# Altium schematic sheet edison_gpio.SchDoc: Edison Breakout
size Letter; Author: Ye-Sheng Kuo; Revision: 1; SheetTotal: 9
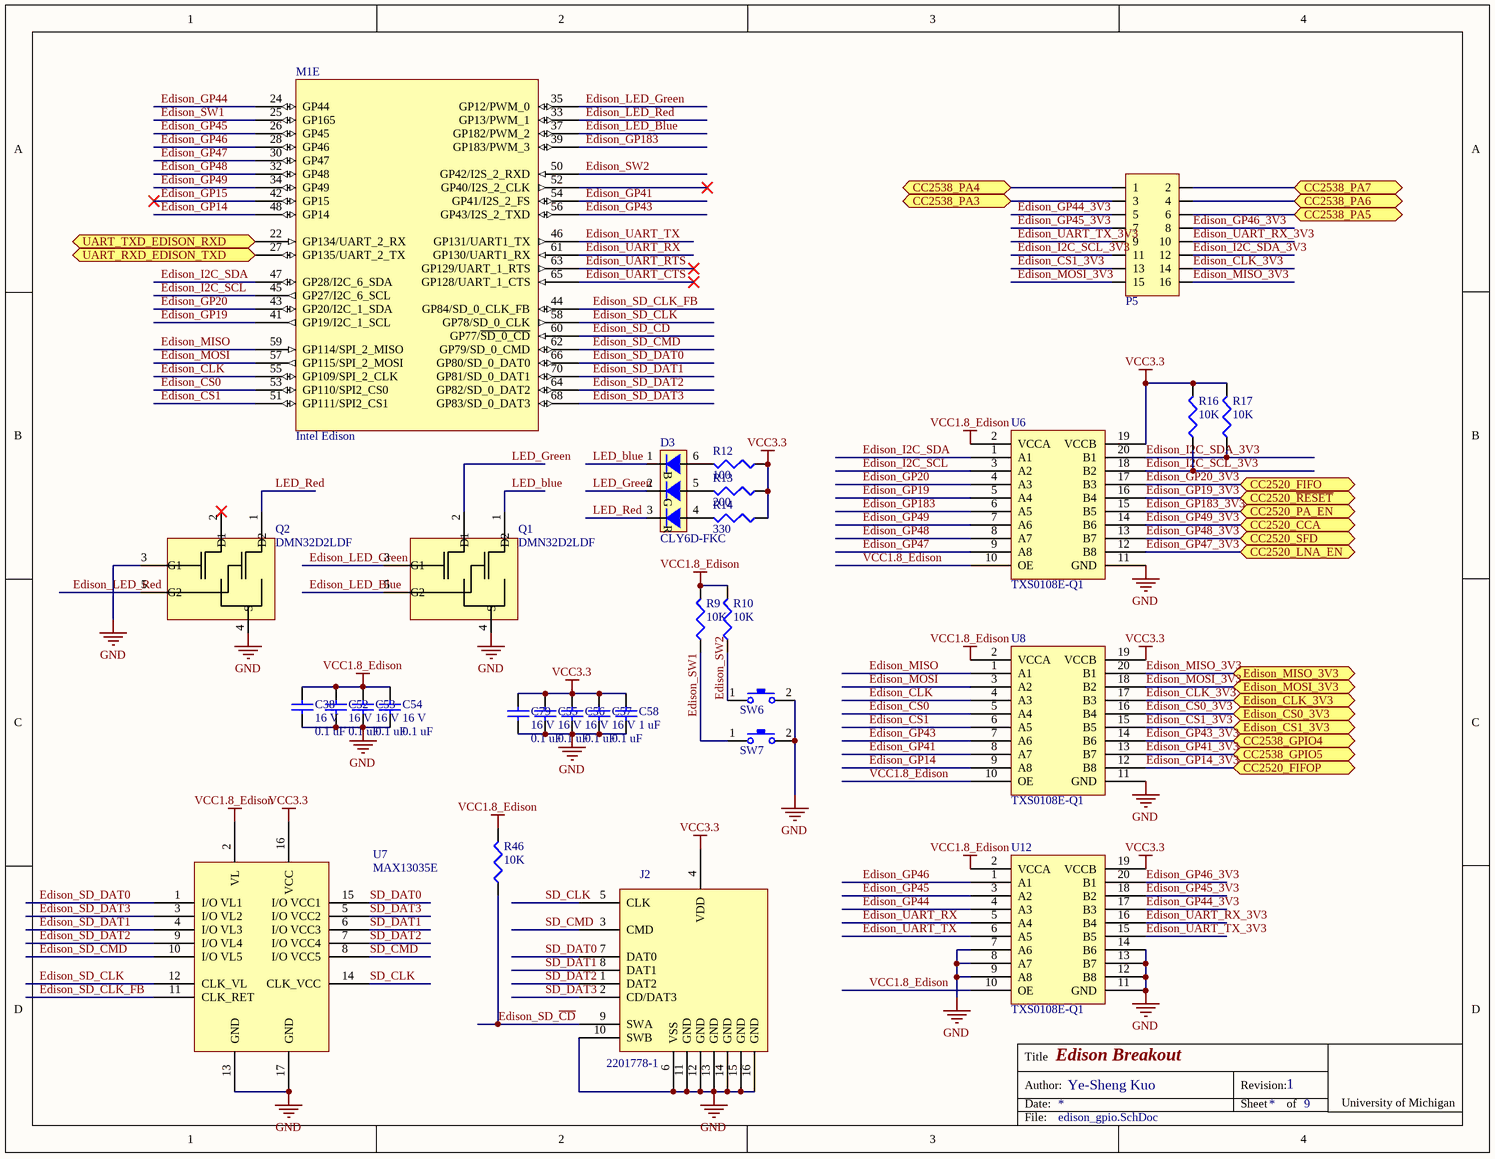
[diagram p0: edison_gpio.SchDoc]

## Parts
C38  value 0.1 uF  voltage rated: 16 V  [0402]  (hidden comment: Ceramic capacitor)
C52  value 0.1 uF  voltage rated: 16 V  [0402]  (hidden comment: Ceramic capacitor)
C53  value 0.1 uF  voltage rated: 16 V  [0402]  (hidden comment: Ceramic capacitor)
C54  value 0.1 uF  voltage rated: 16 V  [0402]  (hidden comment: Ceramic capacitor)
C55  value 0.1 uF  voltage rated: 16 V  [0402]  (hidden comment: Ceramic capacitor)
C56  value 0.1 uF  voltage rated: 16 V  [0402]  (hidden comment: Ceramic capacitor)
C57  value 0.1 uF  voltage rated: 16 V  [0402]  (hidden comment: Ceramic capacitor)
C58  value 1 uF  [0402]  (hidden comment: Ceramic capacitor)
C79  value 0.1 uF  voltage rated: 16 V  [0402]  (hidden comment: Ceramic capacitor)
D3  CLY6D-FKC  [PLCC6]
J2  2201778-1  [2201778-1]
M1  Intel Edison  [Intel Edison mating]  (part E of 5)
P5  2 x 8 header  [2x8 header]  (value not drawn)
Q1  DMN32D2LDF  [SOT-353-5]
Q2  DMN32D2LDF  [SOT-353-5]
R9  value 10K  [0402]  (hidden comment: Chip resistor)
R10  value 10K  [0402]  (hidden comment: Chip resistor)
R12  value 100  [0402]  (hidden comment: Chip resistor)
R13  value 200  [0402]  (hidden comment: Chip resistor)
R14  value 330  [0402]  (hidden comment: Chip resistor)
R16  value 10K  [0402]  (hidden comment: Chip resistor)
R17  value 10K  [0402]  (hidden comment: Chip resistor)
R46  value 10K  [0402]  (hidden comment: Chip resistor)
SW6  1825027-8  [1825027-8]  (value not drawn)
SW7  1825027-8  [1825027-8]  (value not drawn)
U6  TXS0108E-Q1  [TSSOP-20]
U7  MAX13035E  [TQFN-16]
U8  TXS0108E-Q1  [TSSOP-20]
U12  TXS0108E-Q1  [TSSOP-20]

## Ports
CC2520_CCA, CC2520_FIFO, CC2520_FIFOP, CC2520_LNA_EN, CC2520_PA_EN, CC2520_SFD, CC2520_~{RESET}, CC2538_GPIO4, CC2538_GPIO5, CC2538_PA3, CC2538_PA4, CC2538_PA5, CC2538_PA6, CC2538_PA7, Edison_CLK_3V3, Edison_CS0_3V3, Edison_CS1_3V3, Edison_MISO_3V3, Edison_MOSI_3V3, UART_RXD_EDISON_TXD, UART_TXD_EDISON_RXD

## Nets
GND: C38.2 C52.2 C53.2 C54.2 C55.2 C56.2 C57.2 C58.2 C79.2 J2.6(VSS) J2.10(SWB) J2.11(GND) J2.12(GND) J2.13(GND) J2.14(GND) J2.15(GND) J2.16(GND) Q1.4(S) Q2.3(G1) Q2.4(S) SW6.2 SW7.2 U6.11(GND) U7.13(GND) U7.17(GND) U8.11(GND) U12.7(A6) U12.8(A7) U12.9(A8) U12.11(GND) U12.12(B8) U12.13(B7) U12.14(B6)
VCC1.8_Edison: C38.1 C52.1 C53.1 C54.1 R9.1 R10.1 R46.1 U6.2(VCCA) U6.10(OE) U7.2(VL) U8.2(VCCA) U8.10(OE) U12.2(VCCA) U12.10(OE)
VCC3.3: C55.1 C56.1 C57.1 C58.1 C79.1 J2.4(VDD) R12.2 R13.2 R14.2 R16.1 R17.1 U6.19(VCCB) U7.16(VCC) U8.19(VCCB) U12.19(VCCB)
CC2538_PA3: P5.3 ; port CC2538_PA3
CC2538_PA4: P5.1 ; port CC2538_PA4
CC2538_PA5: P5.6 ; port CC2538_PA5
CC2538_PA6: P5.4 ; port CC2538_PA6
CC2538_PA7: P5.2 ; port CC2538_PA7
Edison_CLK: M1.55(GP109/SPI_2_CLK) U8.4(A3)
Edison_CLK_3V3: P5.14 U8.17(B3) ; port Edison_CLK_3V3
Edison_CS0: M1.53(GP110/SPI2_CS0) U8.5(A4)
Edison_CS0_3V3: U8.16(B4) ; port Edison_CS0_3V3
Edison_CS1: M1.51(GP111/SPI2_CS1) U8.6(A5)
Edison_CS1_3V3: P5.13 U8.15(B5) ; port Edison_CS1_3V3
Edison_GP14: M1.48(GP14) U8.9(A8)
Edison_GP14_3V3: U8.12(B8) ; port CC2520_FIFOP
Edison_GP15: M1.42(GP15)
Edison_GP19: M1.41(GP19/I2C_1_SCL) U6.5(A4)
Edison_GP19_3V3: U6.16(B4) ; port CC2520_~{RESET}
Edison_GP20: M1.43(GP20/I2C_1_SDA) U6.4(A3)
Edison_GP20_3V3: U6.17(B3) ; port CC2520_FIFO
Edison_GP41: M1.54(GP41/I2S_2_FS) U8.8(A7)
Edison_GP41_3V3: U8.13(B7) ; port CC2538_GPIO5
Edison_GP43: M1.56(GP43/I2S_2_TXD) U8.7(A6)
Edison_GP43_3V3: U8.14(B6) ; port CC2538_GPIO4
Edison_GP44: M1.24(GP44) U12.4(A3)
Edison_GP44_3V3: P5.5 U12.17(B3)
Edison_GP45: M1.26(GP45) U12.3(A2)
Edison_GP45_3V3: P5.7 U12.18(B2)
Edison_GP46: M1.28(GP46) U12.1(A1)
Edison_GP46_3V3: P5.8 U12.20(B1)
Edison_GP47: M1.30(GP47) U6.9(A8)
Edison_GP47_3V3: U6.12(B8) ; port CC2520_LNA_EN
Edison_GP48: M1.32(GP48) U6.8(A7)
Edison_GP48_3V3: U6.13(B7) ; port CC2520_SFD
Edison_GP49: M1.34(GP49) U6.7(A6)
Edison_GP49_3V3: U6.14(B6) ; port CC2520_CCA
Edison_GP183: M1.39(GP183/PWM_3) U6.6(A5)
Edison_GP183_3V3: U6.15(B5) ; port CC2520_PA_EN
Edison_I2C_SCL: M1.45(GP27/I2C_6_SCL) U6.3(A2)
Edison_I2C_SCL_3V3: P5.11 R16.2 U6.18(B2)
Edison_I2C_SDA: M1.47(GP28/I2C_6_SDA) U6.1(A1)
Edison_I2C_SDA_3V3: P5.12 R17.2 U6.20(B1)
Edison_LED_Blue: M1.37(GP182/PWM_2) Q1.5(G2)
Edison_LED_Green: M1.35(GP12/PWM_0) Q1.3(G1)
Edison_LED_Red: M1.33(GP13/PWM_1) Q2.5(G2)
Edison_MISO: M1.59(GP114/SPI_2_MISO) U8.1(A1)
Edison_MISO_3V3: P5.16 U8.20(B1) ; port Edison_MISO_3V3
Edison_MOSI: M1.57(GP115/SPI_2_MOSI) U8.3(A2)
Edison_MOSI_3V3: P5.15 U8.18(B2) ; port Edison_MOSI_3V3
Edison_SD_~{CD}: J2.9(SWA) M1.60(GP77/~{SD_0_CD}) R46.2
Edison_SD_CLK: M1.58(GP78/SD_0_CLK) U7.12(CLK_VL)
Edison_SD_CLK_FB: M1.44(GP84/SD_0_CLK_FB) U7.11(CLK_RET)
Edison_SD_CMD: M1.62(GP79/SD_0_CMD) U7.10(I/O_VL5)
Edison_SD_DAT0: M1.66(GP80/SD_0_DAT0) U7.1(I/O_VL1)
Edison_SD_DAT1: M1.70(GP81/SD_0_DAT1) U7.4(I/O_VL3)
Edison_SD_DAT2: M1.64(GP82/SD_0_DAT2) U7.9(I/O_VL4)
Edison_SD_DAT3: M1.68(GP83/SD_0_DAT3) U7.3(I/O_VL2)
Edison_SW1: M1.25(GP165) R9.2 SW7.1
Edison_SW2: M1.50(GP42/I2S_2_RXD) R10.2 SW6.1
Edison_UART_CTS: M1.65(GP128/UART_1_CTS)
Edison_UART_RTS: M1.63(GP129/UART_1_RTS)
Edison_UART_RX: M1.61(GP130/UART1_RX) U12.5(A4)
Edison_UART_RX_3V3: P5.10 U12.16(B4)
Edison_UART_TX: M1.46(GP131/UART1_TX) U12.6(A5)
Edison_UART_TX_3V3: P5.9 U12.15(B5)
LED_blue: D3.1 Q1.1(D2)
LED_Green: D3.2 Q1.2(D1)
LED_Red: D3.3 Q2.1(D2)
SD_CLK: J2.5(CLK) U7.14(CLK_VCC)
SD_CMD: J2.3(CMD) U7.8(I/O_VCC5)
SD_DAT0: J2.7(DAT0) U7.15(I/O_VCC1)
SD_DAT1: J2.8(DAT1) U7.6(I/O_VCC3)
SD_DAT2: J2.1(DAT2) U7.7(I/O_VCC4)
SD_DAT3: J2.2(CD/DAT3) U7.5(I/O_VCC2)
UART_RXD_EDISON_TXD: M1.27(GP135/UART_2_TX) ; port UART_RXD_EDISON_TXD
UART_TXD_EDISON_RXD: M1.22(GP134/UART_2_RX) ; port UART_TXD_EDISON_RXD
NetD3_4: D3.4 R14.1
NetD3_5: D3.5 R13.1
NetD3_6: D3.6 R12.1

Not connected (* = marked no-connect by the designer): M1 52(GP40/I2S_2_CLK)*; Q2 2(D1)*

## Notes on the sheet
- Title
- Date:
- Author:
- Revision:
- Sheet
- of
- University of Michigan
- File:
- (in symbol D_CLY6D-FKC) B; G; R

## Library data of the parts
C38 C52-C57 C79 = C_0.1u_16V_0402_ceramic: Ceramic capacitor, 0.1u, 16 V, 0402 package; Manufacture: Murata; tolerance: 10%; Temperature Coef: X7R; package: 0402; Supplier 1: Digi-Key; Supplier Part Number 1: 490-3261-1-ND
C58 = C_1u_16V_0402_ceramic: Ceramic capacitor, 1 uF, 16V, 0402 package; Manufacture: TDK; tolerance: 10%; Temperature rating: X5R; voltage rated: 16 V; package: 0402; Supplier 1: Digi-Key; Supplier Part Number 1: 445-4978-1-ND
D3 = D_CLY6D-FKC: CREE PLCC6 3 in 1 SMD LED; Supplier 1: Digi-Key; Supplier Part Number 1: CLY6D-FKC-CK1N1D1BB7D3D3CT-ND
J2 = 2201778-1: Micro SD Slot; Supplier 1: Digi-Key; Supplier Part Number 1: A118117CT-ND
P5 = 2 x 8 header: 100 mils standard header; Supplier 1: Digi-Key; Supplier Part Number 1: 609-3220-ND
Q1 Q2 = DMN32D2LDF: Common Source Dual N-Channel MOSFET; Supplier 1: Digi-Key; Supplier Part Number 1: DMN32D2LDF-7DICT-ND
R9 R10 R16 R17 R46 = R_10K_0402: Chip resistor, 10K, 0402 package; tolerance: 1%; power: 1/16 W; package: 0402; Supplier 1: Digi-Key; Supplier Part Number 1: 541-10.0KLCT-ND
R12 = R_100_0402: Chip resistor, 100, 0402 package; tolerance: 1%; power: 1/16 W; package: 0402; Supplier 1: Digi-Key; Supplier Part Number 1: 541-100LCT-ND
R13 = R_200_0402: Chip resistor, 200, 0402 package; tolerance: 1%; power: 1/16 W; package: 0402; Supplier 1: Digi-Key; Supplier Part Number 1: 541-200LCT-ND
R14 = R_330_0402: Chip resistor, 330, 0402 package; tolerance: 1%; power: 1/16 W; package: 0402; Supplier 1: Digi-Key; Supplier Part Number 1: 541-330LCT-ND
SW6 SW7 = 1825027-8: SWITCH TACTILE SPST-NO 0.05A 24V; Supplier 1: Digi-Key; Supplier Part Number 1: 450-1657-ND
U6 U8 U12 = TXS0108E-Q1: TXS0108E-Q1 8-Bit Bi-directional, Level-Shifting, Voltage Translator  for Open-Drain and Push-Pull Applications; Supplier 1: Digi-Key; Supplier Part Number 1: 296-42401-1-ND
U7 = MAX13035E: 6-Channel High-Speed Logic-Level Translators; Supplier 1: Digi-Key; Supplier Part Number 1: MAX13035EETE+-ND